# Altium schematic sheet Safety Devices.SchDoc
size A; SheetNumber: 3; SheetTotal: 3
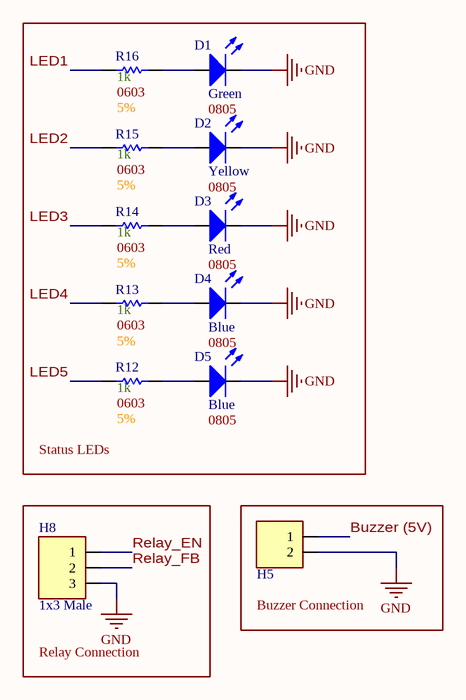
[diagram p0: Safety Devices.SchDoc]

## Parts
D1  Color: Green  Size Package: 0805  [[LED] SMD 0805]  (hidden comment: SMD LED)
D2  Color: Yellow  Size Package: 0805  [[LED] SMD 0805]  (hidden comment: SMD LED)
D3  Color: Red  Size Package: 0805  [[LED] SMD 0805]  (hidden comment: SMD LED)
D4  Color: Blue  Size Package: 0805  [[LED] SMD 0805]  (hidden comment: SMD LED)
D5  Color: Blue  Size Package: 0805  [[LED] SMD 0805]  (hidden comment: SMD LED)
H5  1x2 Male  [[Header] Shrouded 1x2 Male]  (value not drawn)
H8  1x3 Male  [[Header] Shrouded 1x3 Male]
R12  Resistance: 1k  Size Package: 0603  Tolerance: 5%  [[Res] SMD 0603]  (hidden comment: [Res] SMD Resistor)
R13  Resistance: 1k  Size Package: 0603  Tolerance: 5%  [[Res] SMD 0603]  (hidden comment: [Res] SMD Resistor)
R14  Resistance: 1k  Size Package: 0603  Tolerance: 5%  [[Res] SMD 0603]  (hidden comment: [Res] SMD Resistor)
R15  Resistance: 1k  Size Package: 0603  Tolerance: 5%  [[Res] SMD 0603]  (hidden comment: [Res] SMD Resistor)
R16  Resistance: 1k  Size Package: 0603  Tolerance: 5%  [[Res] SMD 0603]  (hidden comment: [Res] SMD Resistor)

## Blocks framed on the sheet
Status LEDs: D1-D5 R12-R16
Relay Connection: H8
Buzzer Connection: H5

## Nets
GND: D1.2(Cathode) D2.2(Cathode) D3.2(Cathode) D4.2(Cathode) D5.2(Cathode) H5.2 H8.3
Buzzer (5V): H5.1
LED1: R16.2
LED2: R15.2
LED3: R14.2
LED4: R13.2
LED5: R12.2
Relay_EN: H8.1
Relay_FB: H8.2
NetD1_1: D1.1(Anode) R16.1
NetD2_1: D2.1(Anode) R15.1
NetD3_1: D3.1(Anode) R14.1
NetD4_1: D4.1(Anode) R13.1
NetD5_1: D5.1(Anode) R12.1

## Library data of the parts
D1-D5 = [LED] SMD: Generic; Part #: *; Supplier 1: DigiKey
  D1: Supplier Part Number 1: 475-LGR971-KN-1CT-ND
  D2: Supplier Part Number 1: 475-LYR976-PS-36-0-20-R18CT-ND
  D3: Supplier Part Number 1: 475-LSR976-NR-1CT-ND
  D4 D5: Supplier Part Number 1: 732-4982-1-ND
H5 = [Header] Shrouded 1x2 Male: 0705430036 / Mates with 0050579402; Supplier 1: DigiKey; Supplier 2: DigiKey; Supplier Part Number 2: WM2900-ND; Supplier Part Number 1: WM4824-ND
H8 = [Header] Shrouded 1x3 Male: 070543-0037 / Mates with 005057-9403; Supplier 1: DigiKey; Supplier 2: DigiKey; Supplier Part Number 1: WM4825-ND; Supplier Part Number 2: WM2901-ND
R12-R16 = [Res] SMD Resistor: Generic; Supplier 1: DigiKey; Supplier Part Number 1: RMCF0603FT1K00DKR-ND